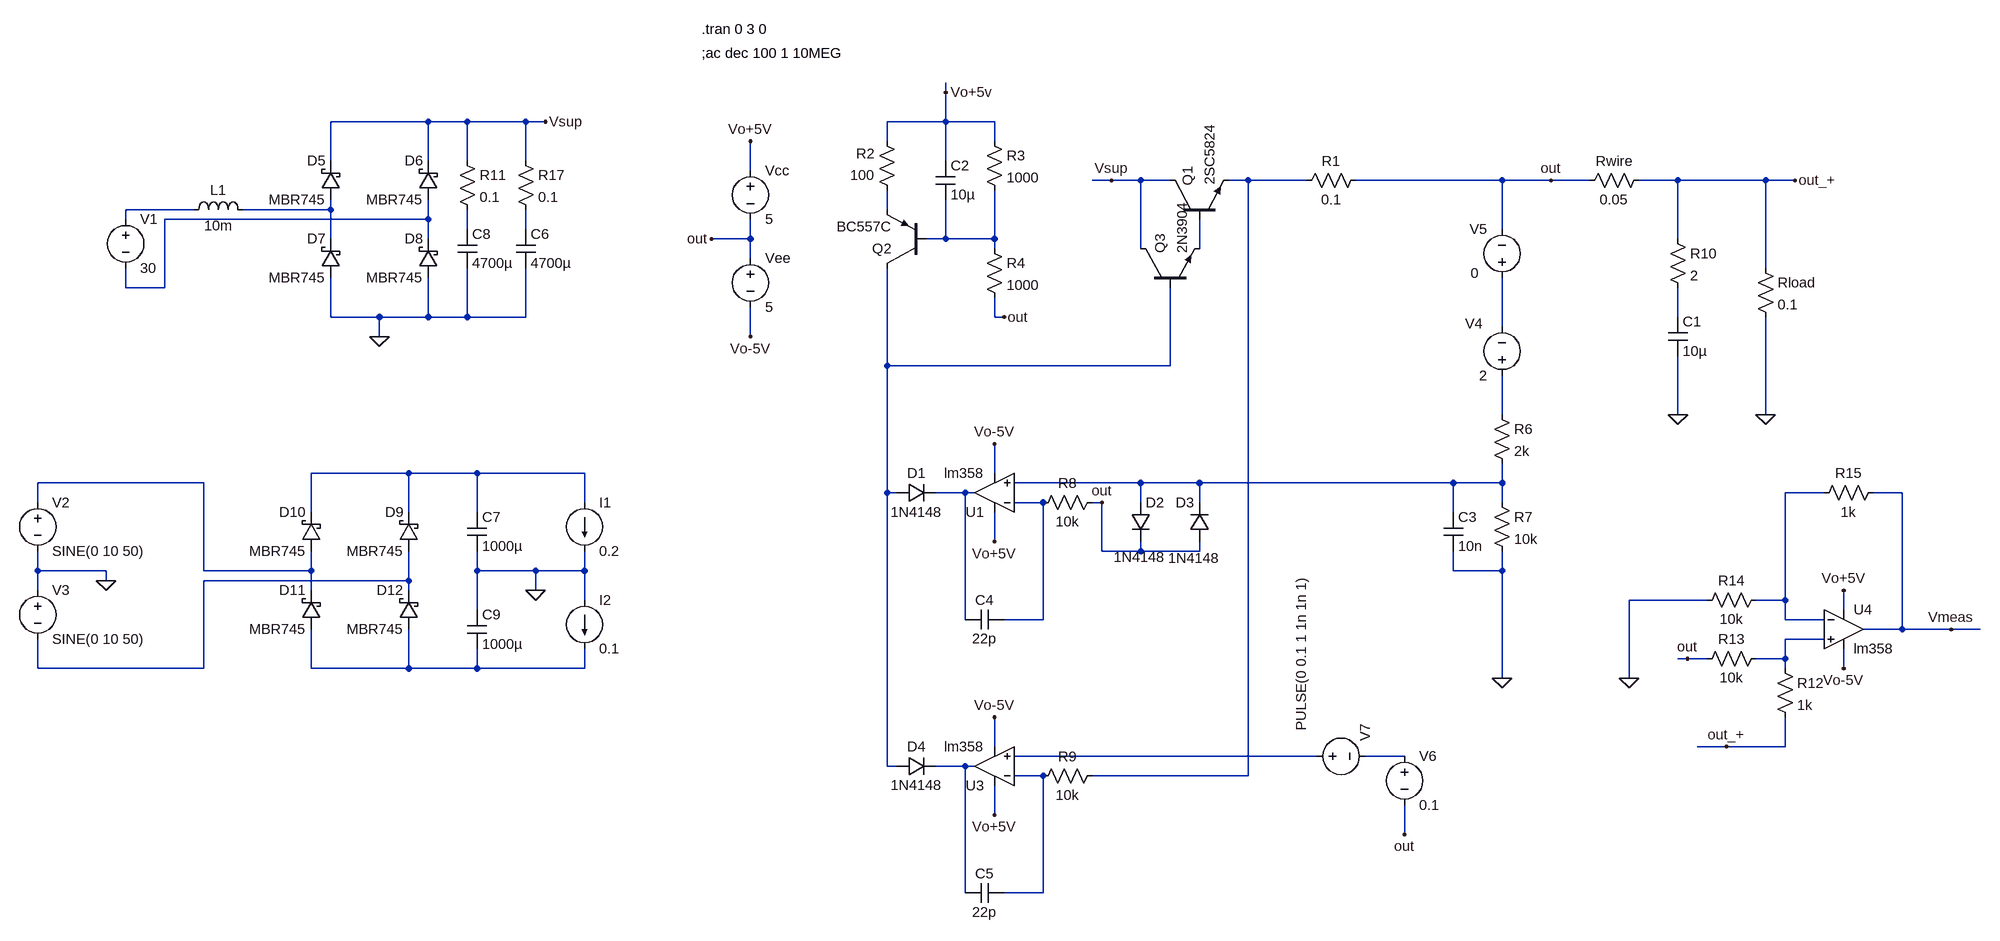
[diagram p0: schematic reg_LM358.asc]
reg_LM358.asc, the LTspice schematic file:
Version 4
SHEET 1 1564 1300
WIRE -176 -80 -176 -96
WIRE -1024 -32 -1184 -32
WIRE -960 -32 -1024 -32
WIRE -864 -32 -960 -32
WIRE -832 -32 -864 -32
WIRE -176 -32 -176 -80
WIRE -176 -32 -272 -32
WIRE -96 -32 -176 -32
WIRE -272 0 -272 -32
WIRE -96 0 -96 -32
WIRE -1184 32 -1184 -32
WIRE -1024 32 -1024 -32
WIRE -960 32 -960 -32
WIRE -864 32 -864 -32
WIRE -176 32 -176 -32
WIRE -496 48 -496 0
WIRE 96 64 64 64
WIRE 144 64 96 64
WIRE 192 64 144 64
WIRE 320 64 288 64
WIRE 416 64 320 64
WIRE 736 64 496 64
WIRE 816 64 736 64
WIRE 880 64 816 64
WIRE 1024 64 960 64
WIRE 1168 64 1024 64
WIRE 1216 64 1168 64
WIRE -1408 112 -1520 112
WIRE -1184 112 -1184 96
WIRE -1184 112 -1328 112
WIRE -272 112 -272 80
WIRE -1520 128 -1520 112
WIRE -1024 128 -1024 96
WIRE -1024 128 -1456 128
WIRE -960 144 -960 112
WIRE -864 144 -864 112
WIRE 736 144 736 64
WIRE -1184 160 -1184 112
WIRE -1024 160 -1024 128
WIRE -496 160 -496 128
WIRE -496 160 -560 160
WIRE -176 160 -176 96
WIRE -176 160 -208 160
WIRE -96 160 -96 80
WIRE -96 160 -176 160
WIRE 1024 160 1024 64
WIRE -96 176 -96 160
WIRE 144 176 144 64
WIRE 240 176 240 128
WIRE -496 192 -496 160
WIRE 1168 208 1168 64
WIRE -1520 240 -1520 208
WIRE -1456 240 -1456 128
WIRE -1456 240 -1520 240
WIRE -1184 288 -1184 224
WIRE -1104 288 -1184 288
WIRE -1024 288 -1024 224
WIRE -1024 288 -1104 288
WIRE -960 288 -960 208
WIRE -960 288 -1024 288
WIRE -864 288 -864 208
WIRE -864 288 -960 288
WIRE -96 288 -96 256
WIRE -80 288 -96 288
WIRE 1024 288 1024 240
WIRE 736 304 736 224
WIRE -1104 320 -1104 288
WIRE -496 320 -496 272
WIRE -272 368 -272 208
WIRE 192 368 192 240
WIRE 192 368 -272 368
WIRE 736 448 736 384
WIRE 1024 448 1024 352
WIRE 1168 448 1168 288
WIRE -1056 544 -1216 544
WIRE -944 544 -1056 544
WIRE -768 544 -944 544
WIRE -96 544 -96 496
WIRE -1392 560 -1664 560
WIRE 144 560 -64 560
WIRE 240 560 144 560
WIRE 656 560 240 560
WIRE 736 560 736 528
WIRE 736 560 656 560
WIRE -272 576 -272 368
WIRE -256 576 -272 576
WIRE -144 576 -192 576
WIRE -128 576 -144 576
WIRE 1264 576 1200 576
WIRE 1392 576 1344 576
WIRE -1664 592 -1664 560
WIRE -768 592 -768 544
WIRE -16 592 -64 592
WIRE 80 592 64 592
WIRE 144 592 144 560
WIRE 240 592 240 560
WIRE 736 592 736 560
WIRE -1216 608 -1216 544
WIRE -1056 608 -1056 544
WIRE -944 608 -944 544
WIRE 656 608 656 560
WIRE -96 656 -96 608
WIRE 80 672 80 592
WIRE 144 672 144 656
WIRE 144 672 80 672
WIRE 240 672 240 656
WIRE 240 672 144 672
WIRE -1664 704 -1664 672
WIRE -1552 704 -1664 704
WIRE -1392 704 -1392 560
WIRE -1216 704 -1216 672
WIRE -1216 704 -1392 704
WIRE -944 704 -944 672
WIRE -848 704 -944 704
WIRE -768 704 -768 672
WIRE -768 704 -848 704
WIRE 656 704 656 672
WIRE 736 704 736 672
WIRE 736 704 656 704
WIRE -1552 720 -1552 704
WIRE -1056 720 -1056 672
WIRE -1056 720 -1392 720
WIRE -1664 736 -1664 704
WIRE -1216 736 -1216 704
WIRE -1056 736 -1056 720
WIRE -848 736 -848 704
WIRE -768 752 -768 704
WIRE 1072 752 944 752
WIRE 1200 752 1200 576
WIRE 1200 752 1152 752
WIRE -944 768 -944 704
WIRE 1296 768 1296 736
WIRE -144 784 -144 576
WIRE -16 784 -16 592
WIRE -16 784 -80 784
WIRE 1200 784 1200 752
WIRE 1264 784 1200 784
WIRE 1392 800 1392 576
WIRE 1392 800 1328 800
WIRE 1472 800 1392 800
WIRE 1520 800 1472 800
WIRE 1264 816 1200 816
WIRE 1040 848 1024 848
WIRE 1072 848 1040 848
WIRE 1200 848 1200 816
WIRE 1200 848 1152 848
WIRE -1664 864 -1664 816
WIRE -1392 864 -1392 720
WIRE -1392 864 -1664 864
WIRE -1216 864 -1216 800
WIRE -1056 864 -1056 800
WIRE -1056 864 -1216 864
WIRE -944 864 -944 832
WIRE -944 864 -1056 864
WIRE -768 864 -768 832
WIRE -768 864 -944 864
WIRE 1200 864 1200 848
WIRE 1296 864 1296 832
WIRE 736 880 736 704
WIRE 944 880 944 752
WIRE -96 992 -96 944
WIRE 1104 992 1056 992
WIRE 1200 992 1200 944
WIRE 1200 992 1104 992
WIRE 432 1008 -64 1008
WIRE 576 1008 512 1008
WIRE -272 1024 -272 576
WIRE -256 1024 -272 1024
WIRE -144 1024 -192 1024
WIRE -128 1024 -144 1024
WIRE -16 1040 -64 1040
WIRE 320 1040 320 64
WIRE 320 1040 64 1040
WIRE -96 1104 -96 1056
WIRE 576 1136 576 1088
WIRE -144 1232 -144 1024
WIRE -16 1232 -16 1040
WIRE -16 1232 -80 1232
FLAG 816 64 out
FLAG -80 288 out
FLAG -560 160 out
FLAG -496 320 Vo-5V
FLAG -496 0 Vo+5V
FLAG -176 -80 Vo+5v
FLAG 1024 448 0
FLAG 1168 448 0
FLAG -96 656 Vo+5V
FLAG -96 496 Vo-5V
FLAG 736 880 0
FLAG 80 592 out
FLAG -96 1104 Vo+5V
FLAG -96 944 Vo-5V
FLAG 576 1136 out
FLAG -832 -32 Vsup
FLAG -1104 320 0
FLAG 1296 736 Vo+5V
FLAG 1296 864 Vo-5V
FLAG 1040 848 out
FLAG 1104 992 out_+
FLAG 1216 64 out_+
FLAG 96 64 Vsup
FLAG 944 880 0
FLAG 1472 800 Vmeas
FLAG -1552 720 0
FLAG -848 736 0
SYMBOL npn 192 128 R270
WINDOW 0 55 29 Left 2
WINDOW 3 56 65 Left 2
SYMATTR InstName Q1
SYMATTR Value 2SC5824
SYMBOL res 512 48 R90
WINDOW 0 0 56 VBottom 2
WINDOW 3 32 56 VTop 2
SYMATTR InstName R1
SYMATTR Value 0.1
SYMBOL res -256 96 R180
WINDOW 0 36 76 Left 2
WINDOW 3 36 40 Left 2
SYMATTR InstName R2
SYMATTR Value 100
SYMBOL pnp -208 208 R180
SYMATTR InstName Q2
SYMATTR Value BC557C
SYMBOL res -112 -16 R0
SYMATTR InstName R3
SYMATTR Value 1000
SYMBOL res -112 160 R0
SYMATTR InstName R4
SYMATTR Value 1000
SYMBOL voltage -496 32 R0
WINDOW 123 0 0 Left 0
WINDOW 39 0 0 Left 0
SYMATTR InstName Vcc
SYMATTR Value 5
SYMBOL voltage -496 176 R0
WINDOW 123 0 0 Left 0
WINDOW 39 0 0 Left 0
SYMATTR InstName Vee
SYMATTR Value 5
SYMBOL res 1152 192 R0
SYMATTR InstName Rload
SYMATTR Value 0.1
SYMBOL cap 1008 288 R0
SYMATTR InstName C1
SYMATTR Value 10µ
SYMBOL diode -256 592 R270
WINDOW 0 32 32 VTop 2
WINDOW 3 0 32 VBottom 2
SYMATTR InstName D1
SYMATTR Value 1N4148
SYMBOL voltage 736 400 R180
WINDOW 0 31 101 Left 2
WINDOW 3 24 16 Left 2
WINDOW 123 0 0 Left 0
WINDOW 39 0 0 Left 0
SYMATTR InstName V4
SYMATTR Value 2
SYMBOL res 720 432 R0
SYMATTR InstName R6
SYMATTR Value 2k
SYMBOL res 720 576 R0
SYMATTR InstName R7
SYMATTR Value 10k
SYMBOL cap -192 32 R0
SYMATTR InstName C2
SYMATTR Value 10µ
SYMATTR SpiceLine Rser=2
SYMBOL cap 640 608 R0
SYMATTR InstName C3
SYMATTR Value 10n
SYMBOL cap -80 768 R90
WINDOW 0 0 32 VBottom 2
WINDOW 3 32 32 VTop 2
SYMATTR InstName C4
SYMATTR Value 22p
SYMATTR SpiceLine Rser=1
SYMBOL voltage 736 240 R180
WINDOW 0 24 96 Left 2
WINDOW 3 38 24 Left 2
WINDOW 123 28 -32 Left 2
WINDOW 39 0 0 Left 0
SYMATTR InstName V5
SYMATTR Value 0
SYMBOL diode 128 592 R0
WINDOW 3 61 91 Left 2
SYMATTR Value 1N4148
SYMATTR InstName D2
SYMBOL diode 256 656 R180
WINDOW 0 24 64 Left 2
WINDOW 3 72 -26 Left 2
SYMATTR InstName D3
SYMATTR Value 1N4148
SYMBOL res 80 576 R90
WINDOW 0 0 56 VBottom 2
WINDOW 3 32 56 VTop 2
SYMATTR InstName R8
SYMATTR Value 10k
SYMBOL diode -256 1040 R270
WINDOW 0 32 32 VTop 2
WINDOW 3 0 32 VBottom 2
SYMATTR InstName D4
SYMATTR Value 1N4148
SYMBOL cap -80 1216 R90
WINDOW 0 0 32 VBottom 2
WINDOW 3 32 32 VTop 2
SYMATTR InstName C5
SYMATTR Value 22p
SYMATTR SpiceLine Rser=1
SYMBOL res 80 1024 R90
WINDOW 0 0 56 VBottom 2
WINDOW 3 32 56 VTop 2
SYMATTR InstName R9
SYMATTR Value 10k
SYMBOL voltage 576 992 R0
WINDOW 123 0 0 Left 0
WINDOW 39 0 0 Left 0
SYMATTR InstName V6
SYMATTR Value 0.1
SYMBOL npn 144 240 R270
SYMATTR InstName Q3
SYMATTR Value 2N3904
SYMBOL voltage -1520 112 R0
WINDOW 123 0 0 Left 0
WINDOW 39 0 0 Left 0
SYMATTR InstName V1
SYMATTR Value 30
SYMBOL schottky -1008 96 R180
WINDOW 0 24 64 Left 2
WINDOW 3 24 0 Left 2
SYMATTR InstName D6
SYMATTR Value MBR745
SYMATTR Description Diode
SYMATTR Type diode
SYMBOL cap -880 144 R0
SYMATTR InstName C6
SYMATTR Value 4700µ
SYMATTR SpiceLine Rser=1m
SYMBOL ind -1424 128 R270
WINDOW 0 32 56 VTop 2
WINDOW 3 5 56 VBottom 2
SYMATTR InstName L1
SYMATTR Value 10m
SYMATTR SpiceLine Rser=10m
SYMBOL voltage 416 1008 R270
WINDOW 0 24 96 Left 2
WINDOW 3 41 -9 Left 2
WINDOW 123 41 19 Left 2
WINDOW 39 0 0 Left 0
SYMATTR InstName V7
SYMATTR Value PULSE(0 0.1 1 1n 1n 1)
SYMBOL lm358 -96 1088 R180
WINDOW 0 16 32 Left 2
WINDOW 38 -88 114 Left 2
SYMATTR InstName U3
SYMBOL lm358 1296 736 R0
WINDOW 0 16 32 Left 2
WINDOW 38 26 92 Left 2
SYMATTR InstName U4
SYMBOL res 1184 848 R0
SYMATTR InstName R12
SYMATTR Value 1k
SYMBOL res 1168 832 R90
WINDOW 0 0 56 VBottom 2
WINDOW 3 32 56 VTop 2
SYMATTR InstName R13
SYMATTR Value 10k
SYMBOL res 1168 736 R90
WINDOW 0 0 56 VBottom 2
WINDOW 3 32 56 VTop 2
SYMATTR InstName R14
SYMATTR Value 10k
SYMBOL res 1360 560 R90
WINDOW 0 0 56 VBottom 2
WINDOW 3 32 56 VTop 2
SYMATTR InstName R15
SYMATTR Value 1k
SYMBOL res 976 48 R90
WINDOW 0 0 56 VBottom 2
WINDOW 3 32 56 VTop 2
SYMATTR InstName Rwire
SYMATTR Value 0.05
SYMBOL res 1008 144 R0
SYMATTR InstName R10
SYMATTR Value 2
SYMBOL schottky -1168 96 R180
WINDOW 0 24 64 Left 2
WINDOW 3 24 0 Left 2
SYMATTR InstName D5
SYMATTR Value MBR745
SYMATTR Description Diode
SYMATTR Type diode
SYMBOL schottky -1168 224 R180
WINDOW 0 24 64 Left 2
WINDOW 3 24 0 Left 2
SYMATTR InstName D7
SYMATTR Value MBR745
SYMATTR Description Diode
SYMATTR Type diode
SYMBOL schottky -1008 224 R180
WINDOW 0 24 64 Left 2
WINDOW 3 24 0 Left 2
SYMATTR InstName D8
SYMATTR Value MBR745
SYMATTR Description Diode
SYMATTR Type diode
SYMBOL cap -976 144 R0
SYMATTR InstName C8
SYMATTR Value 4700µ
SYMBOL res -976 16 R0
SYMATTR InstName R11
SYMATTR Value 0.1
SYMBOL res -880 16 R0
SYMATTR InstName R17
SYMATTR Value 0.1
SYMBOL lm358 -96 640 R180
WINDOW 0 16 32 Left 2
WINDOW 38 -84 124 Left 2
SYMATTR InstName U1
SYMBOL voltage -1664 576 R0
WINDOW 123 0 0 Left 0
WINDOW 39 0 0 Left 0
SYMATTR InstName V2
SYMATTR Value SINE(0 10 50)
SYMBOL schottky -1040 672 R180
WINDOW 0 24 64 Left 2
WINDOW 3 24 0 Left 2
SYMATTR InstName D9
SYMATTR Value MBR745
SYMATTR Description Diode
SYMATTR Type diode
SYMBOL schottky -1200 672 R180
WINDOW 0 24 64 Left 2
WINDOW 3 24 0 Left 2
SYMATTR InstName D10
SYMATTR Value MBR745
SYMATTR Description Diode
SYMATTR Type diode
SYMBOL schottky -1200 800 R180
WINDOW 0 24 64 Left 2
WINDOW 3 24 0 Left 2
SYMATTR InstName D11
SYMATTR Value MBR745
SYMATTR Description Diode
SYMATTR Type diode
SYMBOL schottky -1040 800 R180
WINDOW 0 24 64 Left 2
WINDOW 3 24 0 Left 2
SYMATTR InstName D12
SYMATTR Value MBR745
SYMATTR Description Diode
SYMATTR Type diode
SYMBOL voltage -1664 720 R0
WINDOW 123 0 0 Left 0
WINDOW 39 0 0 Left 0
SYMATTR InstName V3
SYMATTR Value SINE(0 10 50)
SYMBOL cap -960 608 R0
SYMATTR InstName C7
SYMATTR Value 1000µ
SYMBOL cap -960 768 R0
SYMATTR InstName C9
SYMATTR Value 1000µ
SYMBOL load2 -768 592 R0
WINDOW 123 0 0 Left 0
WINDOW 39 0 0 Left 0
SYMATTR InstName I1
SYMATTR Value 0.2
SYMBOL load2 -768 752 R0
WINDOW 123 0 0 Left 0
WINDOW 39 0 0 Left 0
SYMATTR InstName I2
SYMATTR Value 0.1
TEXT -576 -144 Left 2 !;ac dec 100 1 10MEG
TEXT -576 -184 Left 2 !.tran 0 3 0

The netlist it stands for:
* reg_LM358.asc
Q1 Vsup N009 N001 0 2SC5824
R1 out N001 0.1
R2 N004 Vo+5V 100
Q2 N012 N008 N004 0 BC557C
R3 Vo+5V N008 1000
R4 N008 out 1000
Vcc Vo+5V out 5
Vee out Vo-5V 5
Rload out_+ 0 0.1
C1 N010 0 10µ
D1 N012 N017 1N4148
V4 N013 N011 2
R6 N013 N016 2k
R7 N016 0 10k
C2 Vo+5V N008 10µ Rser=2
C3 N016 0 10n
C4 N019 N017 22p Rser=1
V5 N011 out 0
D2 N016 out 1N4148
D3 out N016 1N4148
R8 out N019 10k
D4 N012 N025 1N4148
C5 N026 N025 22p Rser=1
R9 N001 N026 10k
V6 N024 out 0.1
Q3 Vsup N012 N009 0 2N3904
V1 N002 N005 30
D6 N005 Vsup MBR745
C6 N007 0 4700µ Rser=1m
L1 N002 N003 10m Rser=10m
V7 N023 N024 PULSE(0 0.1 1 1n 1n 1)
* U3: lm358 (symbol lm358 not available, pins judged from their places): In+=N023 In-=N026 V+=Vo+5V V-=Vo-5V OUT=N025
* U4: lm358 (symbol lm358 not available, pins judged from their places): In+=N021 In-=N018 V+=Vo+5V V-=Vo-5V OUT=Vmeas
R12 N021 out_+ 1k
R13 N021 out 10k
R14 N018 0 10k
R15 Vmeas N018 1k
Rwire out_+ out 0.05
R10 out_+ N010 2
D5 N003 Vsup MBR745
D7 0 N003 MBR745
D8 0 N005 MBR745
C8 N006 0 4700µ
R11 Vsup N006 0.1
R17 Vsup N007 0.1
* U1: lm358 (symbol lm358 not available, pins judged from their places): In+=N016 In-=N019 V+=Vo+5V V-=Vo-5V OUT=N017
V2 N015 0 SINE(0 10 50)
D9 N020 N014 MBR745
D10 N015 N014 MBR745
D11 N022 N015 MBR745
D12 N022 N020 MBR745
V3 0 N020 SINE(0 10 50)
C7 N014 0 1000µ
C9 0 N022 1000µ
I1 N014 0 0.2
I2 0 N022 0.1
.model D D
.lib standard.dio
.model NPN NPN
.model PNP PNP
.lib standard.bjt
;ac dec 100 1 10MEG
.tran 0 3 0
.backanno
.end